# EAGLE design wcount (EAGLE 6.5.0)
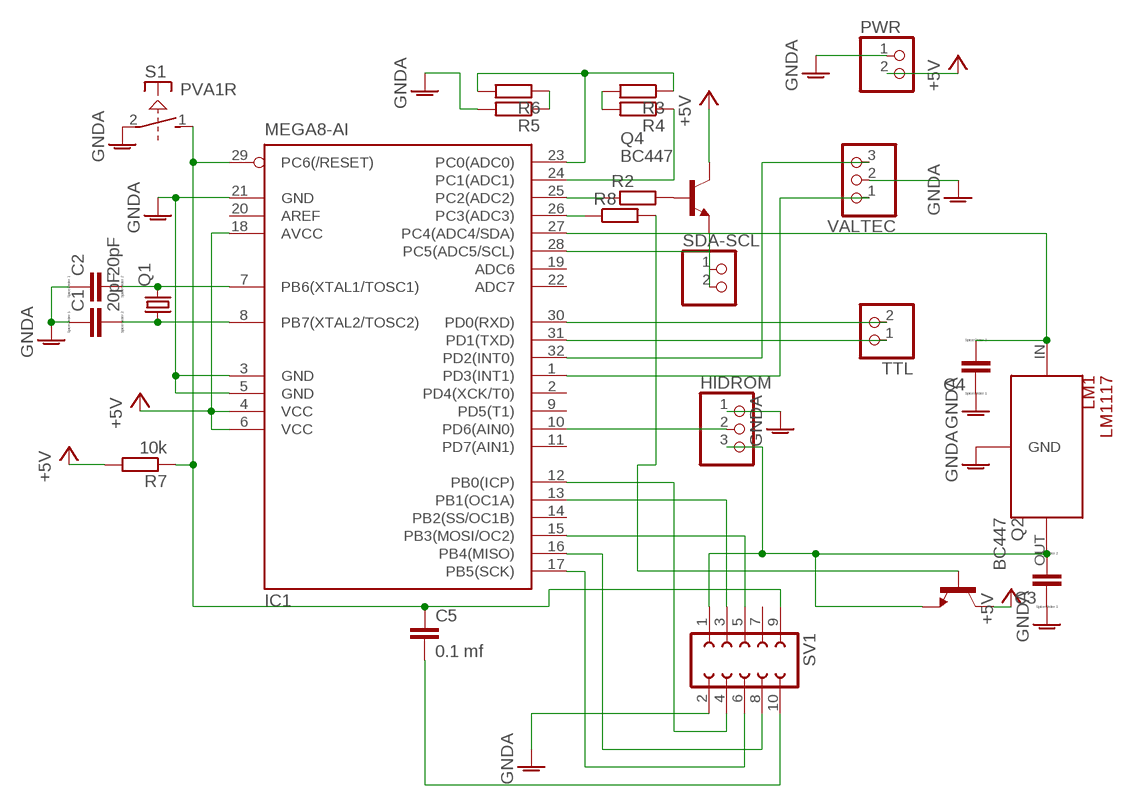
[diagram p0: schematic, sheet 1]

## Parts
C1  20pF  C  [C0805]
C2  20pF  C  [C0805]
C3  C  [C0805]
C4  C  [C0805]
C5  0.1 mf  C-EUC0805  [C0805]
HIDROM  PINHD-1X3  [1X03]
IC1  MEGA8-AI  [TQFP32-08]
LM1  LM1117  [SOT223]
PWR  PINHD-1X2  [1X02]
Q1  CRYSTALHC49S  [HC49/S]
Q2  BC447  [TO92-EBC]
Q4  BC447  [TO92-EBC]
R2  R-EU_R0805  [R0805]
R3  R-EU_R0805  [R0805]
R4  R-EU_R0805  [R0805]
R5  R-EU_R0805  [R0805]
R6  R-EU_R0805  [R0805]
R7  10k  R-EU_R0805  [R0805]
R8  R-EU_R0805  [R0805]
S1  PVA1R  [PVA1R]
SDA-SCL  PINHD-1X2  [1X02]
SV1  FE05-2  [FE05-2]
TTL  PINHD-1X2  [1X02]
VALTEC  PINHD-1X3  [1X03]

## Nets
+5V: IC1.4(VCC) IC1.6(VCC) IC1.18(AVCC) PWR.2 Q2.C Q4.C R7.2
GNDA: C1.1 C2.1 C3.1 C4.1 HIDROM.1 IC1.3(GND) IC1.5(GND) IC1.21(GND) LM1.GND/ADJ(GND) PWR.1 R5.2 S1.2(1:P) SV1.2 VALTEC.2
N$1: IC1.12(PB0(ICP)) SV1.4
N$2: C2.2 IC1.7(PB6(XTAL1/TOSC1)) Q1.2
N$3: IC1.30(PD0(RXD)) TTL.2
N$4: IC1.32(PD2(INT0)) VALTEC.3
N$5: IC1.31(PD1(TXD)) TTL.1
N$8: C4.2 LM1.IN Q4.E
N$9: IC1.24(PC1(ADC1)) R4.1
N$10: IC1.1(PD3(INT1)) VALTEC.1
N$11: IC1.25(PC2(ADC2)) R2.1
N$12: Q4.B R2.2
N$13: C3.2 HIDROM.3 LM1.OUT Q2.E SV1.1
N$14: IC1.17(PB5(SCK)) SV1.6
N$16: R3.2 R4.2
N$17: IC1.16(PB4(MISO)) SV1.8
N$18: IC1.13(PB1(OC1A)) SV1.3
N$19: IC1.15(PB3(MOSI/OC2)) SV1.5
N$20: C5.1 IC1.29(PC6(/RESET)) R7.1 S1.1(1:S) SV1.9
N$21: IC1.23(PC0(ADC0)) R3.1 R6.2
N$22: IC1.27(PC4(ADC4/SDA)) SDA-SCL.1
N$23: IC1.28(PC5(ADC5/SCL)) SDA-SCL.2
N$24: R5.1 R6.1
N$25: HIDROM.2 IC1.10(PD6(AIN0))
N$26: C1.2 IC1.8(PB7(XTAL2/TOSC2)) Q1.1
N$27: IC1.26(PC3(ADC3)) R8.1
N$28: Q2.B R8.2
N$29: C5.2 SV1.10
Unconnected: IC1.2(PD4(XCK/T0)) IC1.9(PD5(T1)) IC1.11(PD7(AIN1)) IC1.14(PB2(SS/OC1B)) IC1.19(ADC6) IC1.20(AREF) IC1.22(ADC7) S1.3(2:S) S1.4(2:P) SV1.7

## Library data of the parts
C1-C4 = eagle-ltspice:C: CAPACITOR, European symbol; SPICEMODEL: NONE; SPICEPREFIX: C
C5 = resistor:C-EU: CAPACITOR, European symbol
HIDROM VALTEC = pinhead:PINHD-1X3: PIN HEADER
IC1 = atmel:MEGA8: MICROCONTROLLER 8 Kbytes FLASH, 1 kbytes SRAM, 512 bytes EEPROM, USART, 6-channel 10 bit ADC, 2-channel 8 bit ADC Pin compatible with Atmega48, ATMega88, ATMega168 Source: avr.lbr; MPN: ATMEGA8-16AU; OC_FARNELL: 9171371; OC_NEWARK: 73M8863
LM1 = linearPower:LM1117
PWR SDA-SCL TTL = pinhead:PINHD-1X2: PIN HEADER
Q1 = crystal:CRYSTAL: CRYSTAL; OC_FARNELL: 1667008; OC_NEWARK: unknown
Q2 Q4 = transistor-npn:BC447*: NPN Transistor
R2-R8 = resistor:R-EU_: RESISTOR, European symbol
S1 = switch-misc:PVA1R: ITT SWITCH
SV1 = con-lsta:FE05-2: FEMALE HEADER; OC_FARNELL: unknown; OC_NEWARK: unknown

## Board
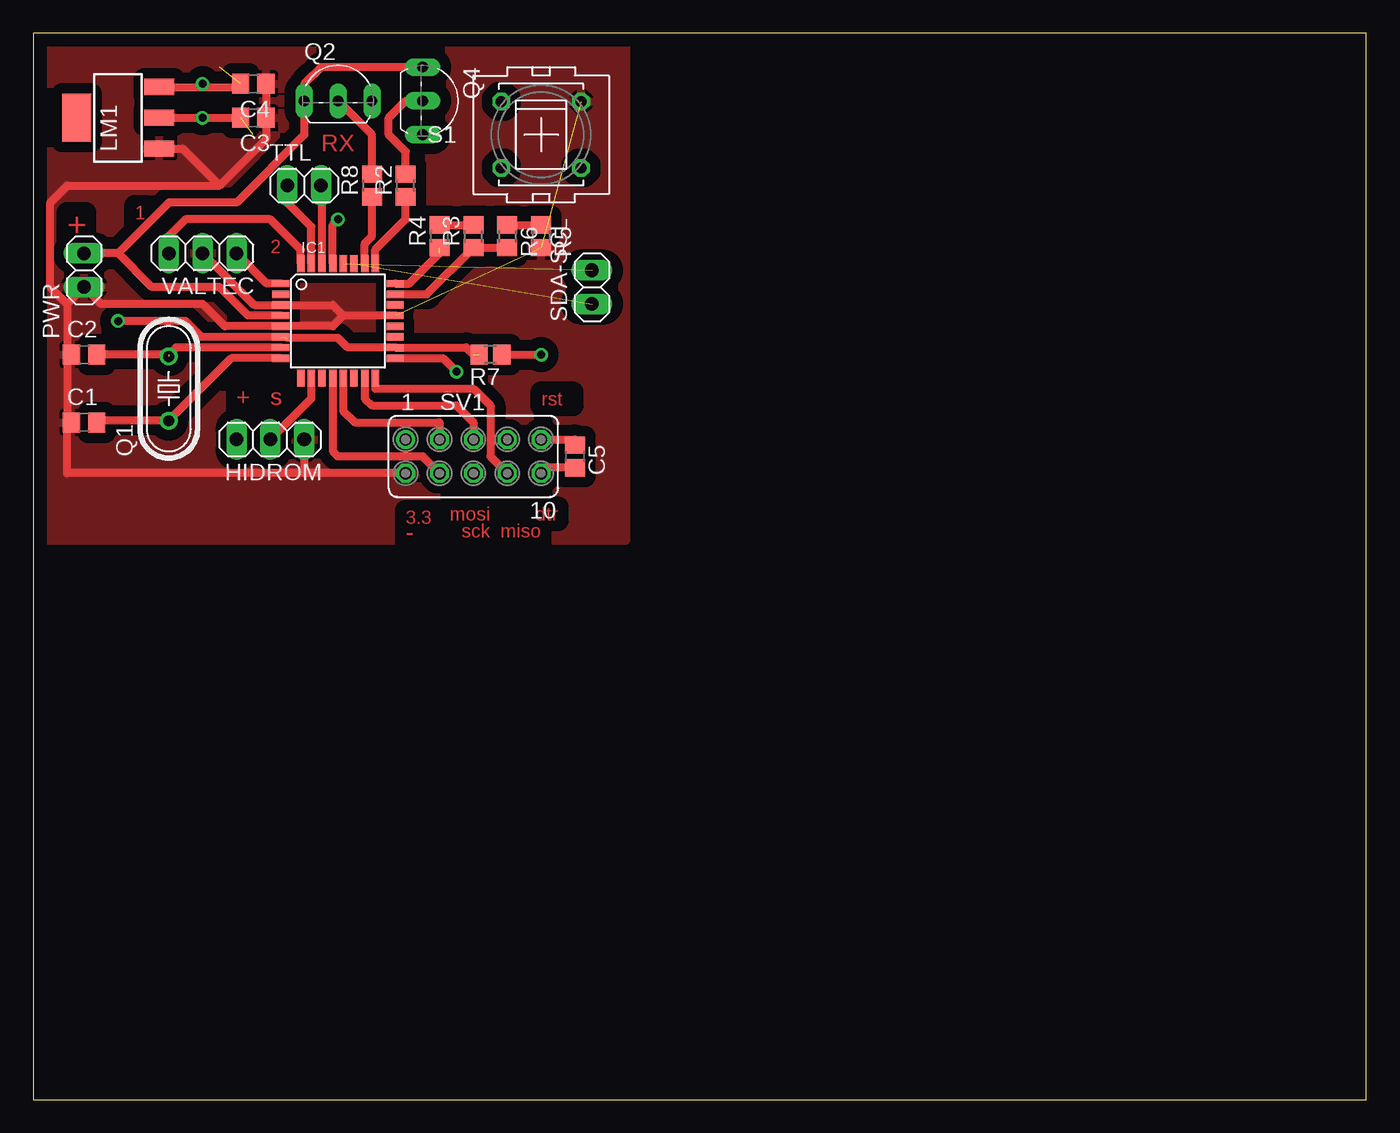
[diagram p1: board, top side]
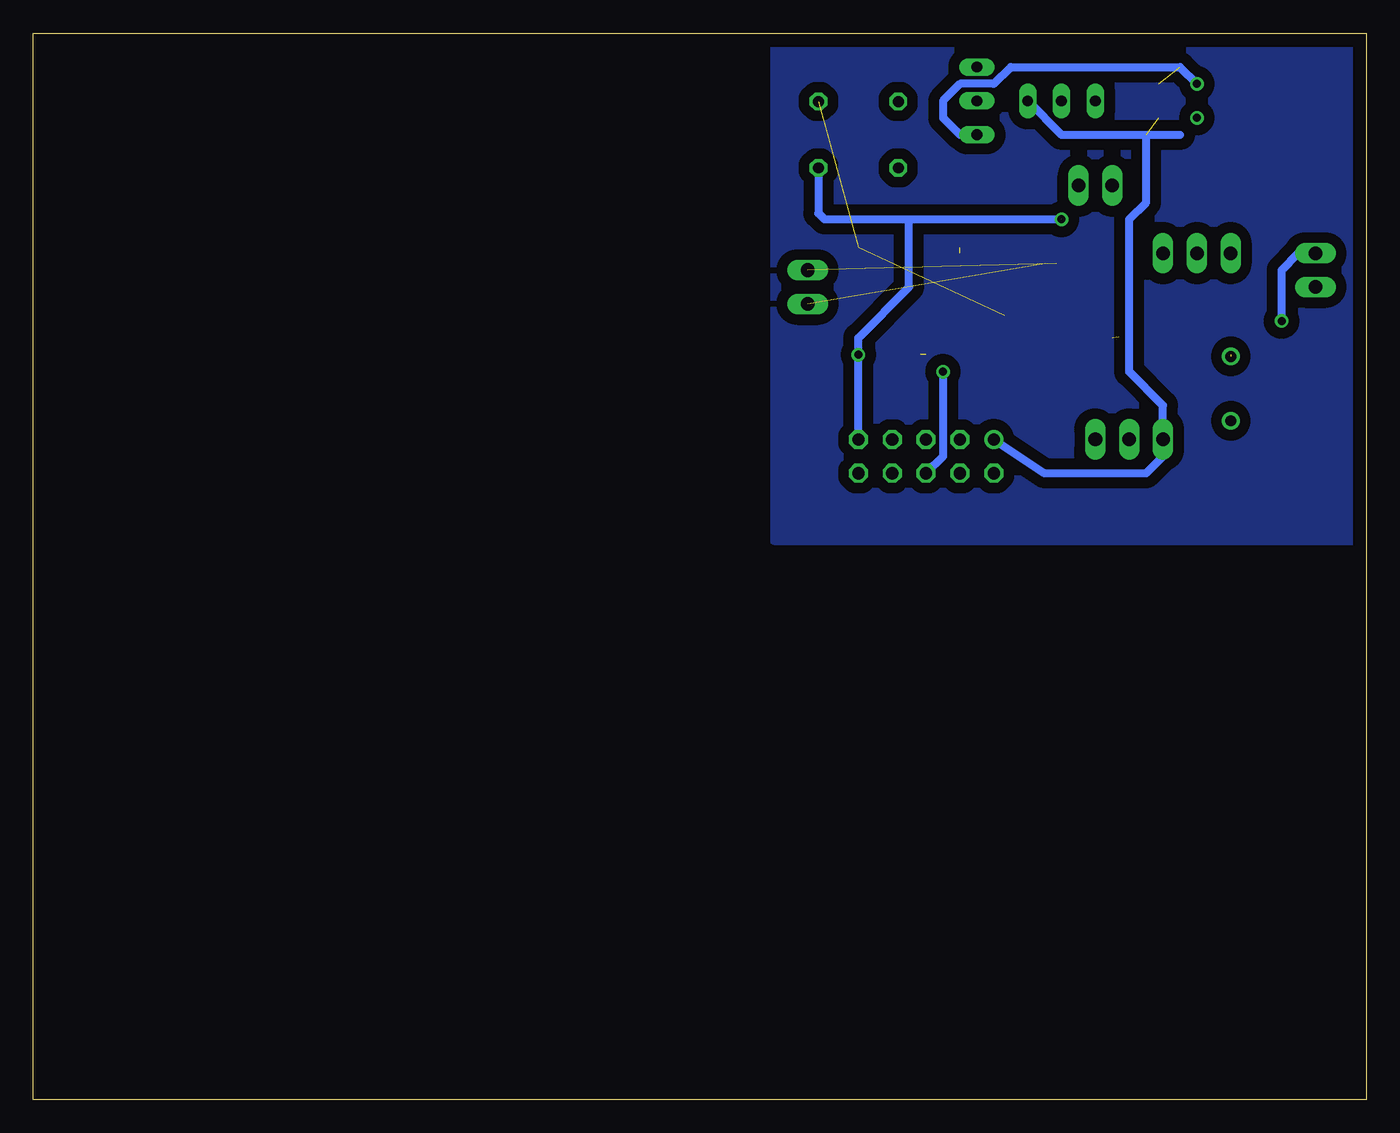
[diagram p2: board, bottom side, seen from below]

Size 100 x 80 mm. Coordinates in mm from the lower left corner, seen from the top.
Outline: 0,0 100,0 100,80 0,80 0,0
Copper layers (1*16): Top 0.035mm / dielectric 1.5mm / Bottom 0.035mm
Design rules "default": minimum track width 20mil, minimum drill 24mil, track to track 12mil, track to pad 12mil, pad to pad 12mil, via to via 12mil, smd to smd 8mil, copper to edge 40mil, drill to drill 8mil, minimum pad ring 10mil, minimum via ring 8mil, stop-mask expansion 4mil, vias tented up to drill 0mil, thermal gap 10mil

### Footprints (pad centres in the part's own frame; a part is rotated, then mirrored left to right if it is on the bottom)
C0805 = smd 1.3 x 1.5: 1 -0.95,0; 2 0.95,0
C0805' = smd 1.3 x 1.5: 1 -0.85,0; 2 0.85,0
1X03 = drill 1.016 long: 1 -2.54,0; 2 0,0; 3 2.54,0
TQFP32-08 = smd 1.27 x 0.559: 1 -4.293,2.8; 2 -4.293,2; 3 -4.293,1.2; 4 -4.293,0.4; 5 -4.293,-0.4; 6 -4.293,-1.2; 7 -4.293,-2; 8 -4.293,-2.8; 17 4.293,-2.8; 18 4.293,-2; 19 4.293,-1.2; 20 4.293,-0.4; 21 4.293,0.4; 22 4.293,1.2; 23 4.293,2; 24 4.293,2.8 | smd 0.559 x 1.27: 9 -2.8,-4.293; 10 -2,-4.293; 11 -1.2,-4.293; 12 -0.4,-4.293; 13 0.4,-4.293; 14 1.2,-4.293; 15 2,-4.293; 16 2.8,-4.293; 25 2.8,4.293; 26 2,4.293; 27 1.2,4.293; 28 0.4,4.293; 29 -0.4,4.293; 30 -1.2,4.293; 31 -2,4.293; 32 -2.8,4.293
SOT223 = smd 3.6 x 2.2: 4 0,3.099 | smd 1.219 x 2.235: GND/ADJ -2.311,-3.099; IN 2.311,-3.099; OUT 0,-3.099
1X02 = drill 1.016 long: 1 -1.27,0; 2 1.27,0
HC49/S = drill 0.813: 1 -2.413,0; 2 2.413,0
TO92-EBC = drill 0.813 long: B 0,-1.27; C -2.54,-1.27; E 2.54,-1.27
R0805 = smd 1.3 x 1.5: 1 -0.85,0; 2 0.85,0
PVA1R = drill 0.813 octagon: 1 -2.997,2.489; 2 -2.997,-2.489; 3 2.997,2.489; 4 2.997,-2.489
FE05-2 = drill 0.914: 1 -5.08,1.27 | drill 0.914 octagon: 2 -5.08,-1.27; 3 -2.54,1.27; 4 -2.54,-1.27; 5 0,1.27; 6 0,-1.27; 7 2.54,1.27; 8 2.54,-1.27; 9 5.08,1.27; 10 5.08,-1.27

### Placement (x,y rotation side)
C1  3.81,50.8 0 top
C2  3.81,55.88 0 top
C3  16.51,73.66 180 top
C4  16.51,76.2 180 top
C5  0.1 mf  [C0805']  40.64,48.26 270 top
HIDROM  17.78,49.53 180 top
IC1  22.86,58.42 0 top
LM1  6.35,73.66 90 top
PWR  3.81,62.23 90 top
Q1  10.16,53.34 90 top
Q2  22.86,76.2 0 top
Q4  30.48,74.93 270 top
R2  27.94,68.58 90 top
R3  33.02,64.77 90 top
R4  30.48,64.77 90 top
R5  38.1,64.77 270 top
R6  35.56,64.77 270 top
R7  34.29,55.88 180 top
R8  25.4,68.58 90 top
S1  38.1,72.39 180 top
SDA-SCL  41.91,60.96 90 top
SV1  33.02,48.26 0 top
TTL  20.32,68.58 0 top
VALTEC  12.7,63.5 180 top

### Tracks (layer width: path | path; a pad name or v marks a point on that pad's centre or on a via)
+5V  (via drill 0.6 pad 0.81)  (2 unrouted)
  Top 0.61: IC1.4 16.11,58.82 13.97,60.96 8.89,60.96 6.35,63.5 | 6.35,63.5 PWR.2 | 6.35,63.5 10.16,67.31 15.24,67.31 20.32,72.39 Q2.C 20.32,76.2 21.59,77.47 Q4.C | 19.05,57.15 22.86,57.15 23.59,56.42 IC1.18 32.48,56.42 33.02,55.88 | IC1.6 12.63,57.22 11.43,58.42 v6.35,58.42
  Bottom 0.61: v6.35,58.42 6.35,62.23 5.08,63.5 PWR.2
GNDA  (2 unrouted)
  Top 0.61: VALTEC.2 16.58,59.62 IC1.3 22.46,59.62 23.26,58.82 | 2.54,59.69 PWR.1 5.08,59.69 12.7,59.69 14.37,58.02 IC1.5 22.46,58.02 23.26,58.82 | 2.54,59.69 2.54,50.8 | 13.97,68.58 2.54,68.58 1.27,67.31 1.27,60.96 2.54,59.69 | 13.97,68.58 17.46,72.07 C3.1 C4.1 | LM1.GND/ADJ 11.2,71.35 13.97,68.58 | IC1.21 23.26,58.82 | HIDROM.1 20.32,46.99 | 20.32,46.99 2.54,46.99 2.54,50.48 C1.1 | SV1.2 20.32,46.99
  pour Top (isolate 0.813): 0,80.01 44.45,80.01 44.45,41.91 0,41.91
N$1
  Top 0.61: SV1.4 29.21,48.26 22.86,48.26 22.46,48.66 IC1.12
N$2  (1 unrouted)
  Top 0.406: 4.89,55.75 C2.2
  Top 0.61: IC1.7 10.7,56.42 10.16,55.88 C2.2
N$3
  Top 0.61: IC1.30 21.66,68.51 TTL.2
N$4
  Top 0.61: VALTEC.3 10.16,64.77 11.43,66.04 17.78,66.04 20.06,63.76 IC1.32
N$5
  Top 0.61: IC1.31 20.86,65.5 19.05,67.31 TTL.1
N$6  (via drill 0.6 pad 0.81)
  other vias: 12.7,76.2
N$7  (via drill 0.6 pad 0.81)
  other vias: 22.86,66.04
N$8  (1 unrouted)
  Top 0.61: LM1.IN 15.33,75.97 C4.2
  Bottom 0.61: 12.7,76.2 13.97,77.47 26.67,77.47 27.94,76.2 30.48,76.2 31.75,74.93 31.75,73.66 30.48,72.39 Q4.E
N$9  (1 unrouted)
  Top 0.61: IC1.24 28.2,61.22 30.48,63.5
N$10
  Top 0.61: IC1.1 17.52,61.22 VALTEC.1
N$11
  Top 0.61: IC1.25 25.66,63.76 27.94,66.04 R2.1
N$12
  Top 0.61: R2.2 27.94,71.12 26.67,72.39 26.67,73.66 27.94,74.93 Q4.B
N$13  (via drill 0.6 pad 0.81)  (1 unrouted)
  Top 0.61: LM1.OUT v12.7,73.66 C3.2
  Bottom 0.61: Q2.E 22.86,72.39 16.51,72.39 | 16.51,72.39 13.97,72.39 | SV1.1 24.13,46.99 16.51,46.99 15.24,48.26 HIDROM.3 15.24,52.07 17.78,54.61 17.78,66.04 16.51,67.31 16.51,72.39
N$14  (via drill 0.6 pad 0.81)
  Top 0.61: IC1.17 30.74,55.62 v31.75,54.61
  Bottom 0.61: v31.75,54.61 31.75,48.26 SV1.6
N$15
  pour Bottom (isolate 0.813): 0,80.01 44.45,80.01 44.45,41.91 0,41.91
N$16
  Top 0.61: R4.2 R3.2
N$17
  Top 0.61: IC1.16 25.66,53.34 33.02,53.34 34.29,52.07 34.29,48.26 SV1.8
N$18
  Top 0.61: IC1.13 23.26,51.67 24.13,50.8 30.48,50.8 SV1.3
N$19
  Top 0.61: IC1.15 24.86,52.61 25.4,52.07 31.75,52.07 33.02,50.8 SV1.5
N$20  (via drill 0.6 pad 0.81)  (1 unrouted)
  Top 0.61: IC1.29 22.46,65.64 22.86,66.04 | R7.1 v38.1,55.88 | SV1.9 40.64,49.53 C5.1
  Bottom 0.61: SV1.9 v38.1,55.88 38.1,57.15 34.29,60.96 34.29,66.04 | 34.29,66.04 22.86,66.04 | S1.1 41.1,66.5 40.64,66.04 34.29,66.04
N$21
  Top 0.61: R6.2 R3.1 29.52,60.42 IC1.23
N$22  (1 unrouted)
N$23  (1 unrouted)
N$24
  Top 0.61: R6.1 R5.1
N$25
  Top 0.61: IC1.10 20.86,52.61 HIDROM.2
N$26
  Top 0.406: 5.21,50.93 5.08,50.8 C1.2
  Top 0.61: IC1.8 14.85,55.62 Q1.1 4.89,50.93 C1.2
N$27
  Top 0.61: IC1.26 24.86,64.23 25.4,64.77 R8.1
N$28
  Top 0.61: R8.2 25.4,72.39 Q2.B
N$29
  Top 0.61: C5.2 38.1,47.41 SV1.10

### Text on the board
Top: RX | 1 | + | 2 | + | s | rst | mosi | dtr | 3.3 | sck | miso | -